# Altium schematic sheet GateDriverandMosfets.SchDoc: Gate Driver and MOSFETs
size A4; ApprovedBy: Ekrem Turan Fırat; CheckedBy: Ekrem Turan Fırat; Author: Ekrem Turan Fırat; CompanyName: Mergen Elektronik; DrawnBy: Ekrem T. Fırat; Engineer: Ekrem Turan Fırat; Organization: Mergen Elektronik; Address1: Türkiye; DocumentNumber: 20240101; Revision: v0.0.1; SheetNumber: 5; SheetTotal: 7
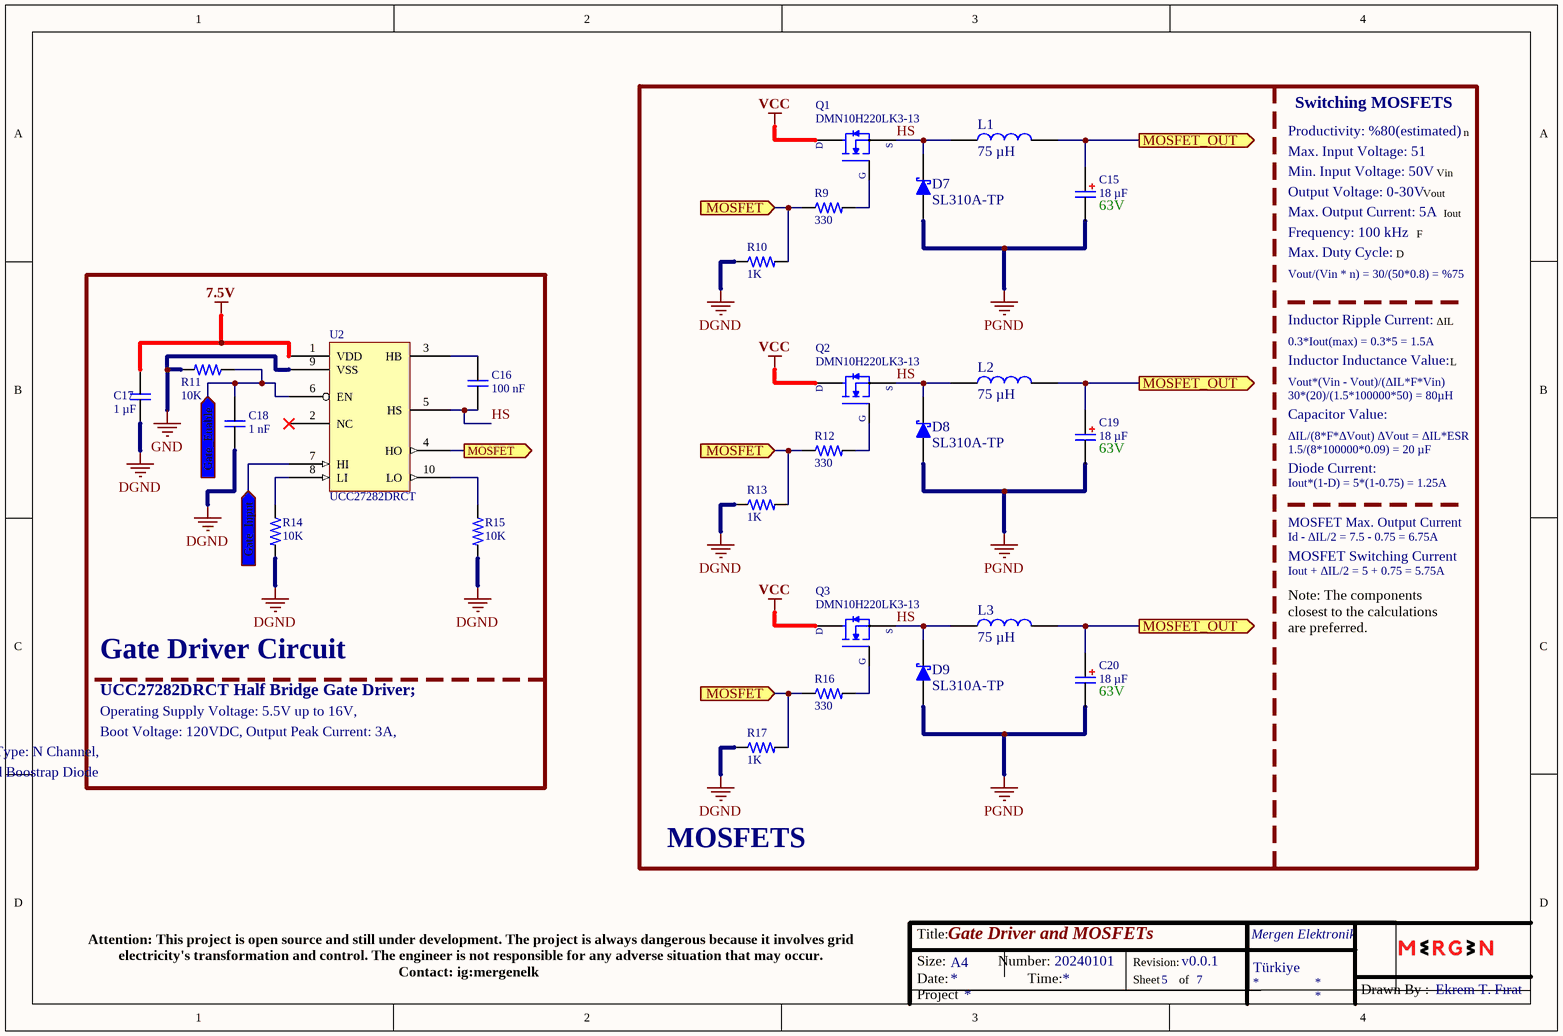
[diagram p0: GateDriverandMosfets.SchDoc]

## Parts
C15  18 µF  Voltage Rated: 63V  [MergenElektronik_Capacitors_AluminumElectrolytics_THTs_8x7MM]
C16  100 nF  [MergenElektronik_Capacitors_Ceramics_SMDs_0603_S_NS]
C17  1 µF  [MergenElektronik_Capacitors_Ceramics_SMDs_1206_S_NS]
C18  1 nF  [MergenElektronik_Capacitors_Ceramics_SMDs_0402_S_NS]
C19  18 µF  Voltage Rated: 63V  [MergenElektronik_Capacitors_AluminumElectrolytics_THTs_8x7MM]
C20  18 µF  Voltage Rated: 63V  [MergenElektronik_Capacitors_AluminumElectrolytics_THTs_8x7MM]
D7  SL310A-TP  [MergenElektronik_Diodes_SchottkyDiodes_DO-214AC (SMA)]
D8  SL310A-TP  [MergenElektronik_Diodes_SchottkyDiodes_DO-214AC (SMA)]
D9  SL310A-TP  [MergenElektronik_Diodes_SchottkyDiodes_DO-214AC (SMA)]
L1  75 µH  [MergenElektronik_Inductors_PowerInductors_SMDs_8x8x4mm_Shielded]
L2  75 µH  [MergenElektronik_Inductors_PowerInductors_SMDs_8x8x4mm_Shielded]
L3  75 µH  [MergenElektronik_Inductors_PowerInductors_SMDs_8x8x4mm_Shielded]
Q1  DMN10H220LK3-13  [MergenElektronik_Transistors_Mosfets_TO-252-3(DPAK)]
Q2  DMN10H220LK3-13  [MergenElektronik_Transistors_Mosfets_TO-252-3(DPAK)]
Q3  DMN10H220LK3-13  [MergenElektronik_Transistors_Mosfets_TO-252-3(DPAK)]
R9  330  [MergenElektronik_Resistors_ChipResistors_0603_S_NS]
R10  1K  [MergenElektronik_Resistors_ChipResistors_0603_S_NS]
R11  10K  [MergenElektronik_Resistors_ChipResistors_0603_S_NS]
R12  330  [MergenElektronik_Resistors_ChipResistors_0603_S_NS]
R13  1K  [MergenElektronik_Resistors_ChipResistors_0603_S_NS]
R14  10K  [MergenElektronik_Resistors_ChipResistors_0603_S_NS]
R15  10K  [MergenElektronik_Resistors_ChipResistors_0603_S_NS]
R16  330  [MergenElektronik_Resistors_ChipResistors_0603_S_NS]
R17  1K  [MergenElektronik_Resistors_ChipResistors_0603_S_NS]
U2  UCC27282DRCT  [MergenElektronik_Logics_GateDrivers_10VSON]

## Blocks framed on the sheet
MOSFETS: C15 C19 C20 D7-D9 L1-L3 Q1-Q3 R9 R10 R12 R13 R16 R17
Gate Driver Circuit: C16-C18 R11 R14 R15 U2

## Ports
Gate_Enable (in, see MicroController[3B]), Gate_Input (in, see MicroController[3B]), MOSFET (in, see GateDriverandMosfets[2A], GateDriverandMosfets[2B]), MOSFET (in, see GateDriverandMosfets[2A], GateDriverandMosfets[2B], GateDriverandMosfets[2C]), MOSFET (in, see GateDriverandMosfets[2B], GateDriverandMosfets[2C]), MOSFET (out, see GateDriverandMosfets[2A], GateDriverandMosfets[2B], GateDriverandMosfets[2C]), MOSFET_OUT (out, see GateDriverandMosfets[3A], GateDriverandMosfets[3B], Measuring[2C]), MOSFET_OUT (out, see GateDriverandMosfets[3A], GateDriverandMosfets[3C], Measuring[2C]), MOSFET_OUT (out, see GateDriverandMosfets[3B], GateDriverandMosfets[3C], Measuring[2C])

## Nets
7.5V: C17.1 U2.1(VDD)
DGND: C17.2 C18.2 R10.1 R13.1 R14.2 R15.2 R17.1
GND: R11.2 U2.9(VSS)
PGND: C15.KATOT C19.KATOT C20.KATOT D7.1(ANOT) D8.1(ANOT) D9.1(ANOT)
VCC: Q1.3(Drain) Q2.3(Drain) Q3.3(Drain)
Gate_Enable: C18.1 R11.1 U2.6(EN) ; port Gate_Enable
Gate_Input: U2.7(HI) ; port Gate_Input
HS: C16.2 D7.2(KATOT) D8.2(KATOT) D9.2(KATOT) L1.1 L2.1 L3.1 Q1.2(Source) Q2.2(Source) Q3.2(Source) U2.5(HS)
MOSFET: R9.1 R10.2 R12.1 R13.2 R16.1 R17.2 U2.4(HO) ; port MOSFET
MOSFET_OUT: C15.ANOT C19.ANOT C20.ANOT L1.2 L2.2 L3.2 ; port MOSFET_OUT
NetC16_1: C16.1 U2.3(HB)
NetQ1_1: Q1.1(Gate) R9.2
NetQ2_1: Q2.1(Gate) R12.2
NetQ3_1: Q3.1(Gate) R16.2
NetR14_1: R14.1 U2.8(LI)
NetR15_1: R15.1 U2.10(LO)

Not connected (* = marked no-connect by the designer): U2 2(NC)*

## Notes on the sheet
- Switching MOSFETS
- Productivity: %80(estimated)
- Max. Input Voltage: 51
- Min. Input Voltage: 50V
- Vin
- n
- Output Voltage: 0-30V
- Max. Output Current: 5A
- Frequency: 100 kHz
- F
- Vout
- Iout
- Max. Duty Cycle:
- Vout/(Vin * n) = 30/(50*0.8) = %75
- D
- Inductor Ripple Current:
- 0.3*Iout(max) = 0.3*5 = 1.5A
- Inductor Inductance Value:
- Vout*(Vin - Vout)/(ΔIL*F*Vin)
- ΔIL
- L
- 30*(20)/(1.5*100000*50) = 80µH
- Capacitor Value:
- ΔIL/(8*F*ΔVout) ΔVout = ΔIL*ESR
- 1.5/(8*100000*0.09) = 20 µF
- Diode Current:
- Iout*(1-D) = 5*(1-0.75) = 1.25A
- MOSFET Max. Output Current
- Id - ΔIL/2 = 7.5 - 0.75 = 6.75A
- MOSFET Switching Current
- Iout + ΔIL/2 = 5 + 0.75 = 5.75A
- Note: The components closest to the calculations are preferred.
- UCC27282DRCT Half Bridge Gate Driver;
- Operating Supply Voltage: 5.5V up to 16V,
- Boot Voltage: 120VDC, Output Peak Current: 3A,
- Integreted Boostrap Diode
- Gate Type: N Channel,
- Attention: This project is open source and still under development. The project is always dangerous because it involves grid electricity's transformation and control. The engineer is not responsible for any adverse situation that may occur.
  Contact: ig:mergenelk
- Title:
- Size:
- Date:
- A4
- Number:
- Time:
- Revision:
- Sheet
- of
- Project
- Drawn By :
- (in symbol MergenElektronik_Transistors_Mosfets_DMN10H220LK3-13) D; S; G

## Library data of the parts
C15 C19 C20 = MergenElektronik_Capacitors_AluminumElectrolytics_SMDs_63SXE18M: Mergen Elektronik- Capacitors - Aluminum Electrolytics - THTs - 63SXE18M; Manufacturer: Panasonic; Manufacturer Number: 100SXE6R8M; Model: Aluminum Electrolytic Capacitors; Tolerance: ±20%; Value: 18 µF; Temperature: -55°C up to +125°C; Digi-Key Number: P122614-ND; Package: 8x7mm; Farnell Number: 2920530; Mouser Number: 667-63SXE18M; Mounting Type: Through Hole; Supplier 1: Digikey; Supplier 2: Mouser; Supplier Part Number 1: P122614-ND; Supplier Part Number 2: 667-63SXE18M; Özdisan Number: 63SXE18M
C16 = MergenElektronik_Capacitors_Ceramic_SMDs_100nF_100V: Mergen Elektronik - Capacitors - Ceramics - SMDs - 0603 - 100 nF - 100V; Manufacturer: Samsung; Manufacturer Number: CL10B104KC8NNNC; Model: Ceramic Capacitors; Tolerance: ±10%; Value: 100 nF; Temperature: -55°C up to +125°C; Digi-Key Number: 1276-6807-1-ND; Package: 0603(1608 Metric); Mouser Number: 187-CL10B104KC8NNNC; Mounting Type: Surface Mount; Farnell Number: 3013412; Özdisan Number: CL10B104KC8NNNC; Supplier 1: Digikey; Supplier 2: Mouser; Supplier Part Number 1: 1276-6807-1-ND; Supplier Part Number 2: 187-CL10B104KC8NNNC; Voltage Rated: 100V
C17 = MergenElektronik_Capacitors_Ceramic_SMDs_1µF_100V: Mergen Elektronik - Capacitors - Ceramics - SMDs - 1206 - 1 µF - 100V; Manufacturer: Samsung; Manufacturer Number: CL31B105KCHNNNE; Model: Ceramic Capacitors; Tolerance: ±10%; Value: 1 µF; Temperature: -55°C up to +125°C; Digi-Key Number: 1276-1838-1-ND; Package: 1206(3216 Metric); Mouser Number: 187-CL31B105KCHNNNE; Mounting Type: Surface Mount; Özdisan Number: CL31B105KCHNNNE; Supplier 1: Digikey; Supplier 2: Mouser; Supplier Part Number 1: 1276-1838-1-ND; Supplier Part Number 2: 187-CL31B105KCHNNNE; Voltage Rated: 100V
C18 = MergenElektronik_Capacitors_Ceramic_SMDs_1nF_50V: Mergen Elektronik - Capacitors - Ceramics - SMDs - 0402 - 1 nF - 50V; Manufacturer: Murata Electronics; Manufacturer Number: GRM1555C1H102JA01D; Model: Ceramic Capacitors; Tolerance: ±5%; Value: 1 nF; Temperature: -55°C up to +125°C; Digi-Key Number: 490-3244-1-ND; Package: 0402(1005 Metric); Mouser Number: 81-GRM1555C1H102JA1D; Mounting Type: Surface Mount; Farnell Number: 8819556; Özdisan Number: GRM1555C1H102JA01D; Supplier 1: Digikey; Supplier 2: Mouser; Voltage Rated: 50V; Supplier Part Number 1: 490-3244-1-ND; Supplier Part Number 2: 81-GRM1555C1H102JA1D
D7-D9 = MergenElektronik_Diodes_SchottkyDiodes_SL310A-TP: Mergen Elektronik - Diodes - Schottky Diodes - SL310A-TP; Manufacturer: Micro Commercial Co; Voltage Rated: 100V; Current Rating: 3A; Value: VSSB7L45-M3/52T; Digi-Key Number: SL310A-TPMSTR-ND; Manufacturer Number: SL310A-TP; Model: Schottky Diodes; Mounting Type: Surface Mount; Package: DO-214AC(SMA); Temperature: -55°C up to +150°C; Supplier 1: Digikey; Supplier 2: Mouser; Supplier Part Number 1: SL310A-TPMSDKR-ND; Supplier Part Number 2: 833-SL310A-TP; Mouser Number: 833-SL310A-TP
L1-L3 = MergenElektronik_Inductors_PowerInductors_SMDs_ASPI-8040S-750M-T: Mergen Elektronik - Inductors - Power Inductors - SMDs - 8x8mm  75-µh - 1.2A; Manufacturer: Abracon LLC; Digi-Key Number: 535-13053-1-ND; Manufacturer Number: ASPI-8040S-750M-T; Model: Power Inductor; Mounting Type: Surface Mount; Package: 8x8x4mm Shielded; Temperature: -40°C up to  125°C; Value: 75 µH; Current Rating: 1.2A; Mouser Number: 815-ASPI-8040S-750MT; Supplier 1: Digikey; Supplier 2: Mouser; Supplier Part Number 1: 535-13053-1-ND; Supplier Part Number 2: 815-ASPI-8040S-750MT
Q1-Q3 = MergenElektronik_Transistors_Mosfets_DMN10H220LK3-13: Mergen Elektronik - Transistors - Mosfets - DMN10H220LK3-13; Manufacturer: Diodes Incorporated; Voltage Rated: 100V; Model: Mosfet; Id: 7.5A; Value: DMN10H220LK3-13; Temperature: -55°C up to +175°C (TJ); Digi-Key Number: 31-DMN10H220LK3-13CT-ND; Manufacturer Number: DMN10H220LK3-13; Package: TO-252-3 DPAK; Mounting Type: Surface Mount; Vdss: 100V; Rating Current: 7.5A; Mouser Number: 621-DMN10H220LK3-13; Farnell Number: 3943521RL; Current Rating: 7.5A; Supplier 1: Digikey; Supplier 2: Mouser; Supplier Part Number 1: 31-DMN10H220LK3-13CT-ND; Supplier Part Number 2: 621-DMN10H220LK3-13
R9 R12 R16 = MergenElektronik_Resistors_ChipResistors_0603_330R: Mergen Elektronik - Resistors - Chip Resistors - 0603 - 330R; Manufacturer: Stackpole; Manufacturer Number: RMCF0603JT330R; Value: Chip Resistor - 0603 - 330R; Power: 1/10W; Tolerance: ±5%; Package: 0603(1608); Temperature: -55°C up to +155°C - X8R; Model: Chip Resistor; Digi-Key Number: RMCF0603JT330RCT-ND; Mounting Type: Surface Mount; Supplier 1: Digi-Key; Supplier Part Number 1: RMCF0603JT330RCT-ND
R10 R13 R17 = MergenElektronik_Resistors_ChipResistors_0603_1K: Mergen Elektronik - Resistors - Chip Resistors - 0603 - 1K; Manufacturer: Stackpole; Manufacturer Number: RMCF0603JT1K00; Value: Chip Resistor - 0603 - 1K; Power: 1/10W; Tolerance: ±5%; Package: 0603(1608); Temperature: -55°C up to +155°C - X8R; Model: Chip Resistor; Digi-Key Number: RMCF0603JT1K00CT-ND; Mounting Type: Surface Mount; Mouser Number: 708-RMCF0603JT1K00; Supplier 1: Digikey; Supplier 2: Mouser; Supplier Part Number 1: RMCF0603JT1K00DKR-ND; Supplier Part Number 2: 708-RMCF0603JT1K00
R11 R14 R15 = MergenElektronik_Resistors_ChipResistors_0603_10K: Mergen Elektronik - Resistors - Chip Resistors - 0603 - 10K; Manufacturer: Stackpole; Manufacturer Number: RMCF0603JT10K0; Value: Chip Resistor - 0603 - 10K; Power: 1/10W; Tolerance: ±5%; Package: 0603(1608); Temperature: -55°C up to +155°C - X8R; Model: Chip Resistor; Digi-Key Number: RMCF0603JT10K0CT-ND; Mounting Type: Surface Mount; Supplier 1: Digi-Key; Supplier Part Number 1: RMCF0603JT10K0-ND
U2 = MergenElektronik_Logics_GateDrivers_UCC27282DRCT: Mergen Elektronik - Logics - Gate Drivers - UCC27282DRCT; Manufacturer: Texas Instruments; Operating Supply Voltage: 5.5V up to 16VDC; Voltage Rated: 120VDC; Current Rating: 3A; Gate Driver Type: Half Bridge; Channel Type: İndependent; Gaye Type: N-Channel MOSFET; Digi-Key Number: 296-53422-1-ND; Manufacturer Number: UCC27282DRCT; Model: Gate Driver; Mounting Type: Surface Mount; Mouser Number: 595-UCC27282DRCT; Package: 10-VSON 3x3; Temperature: -40°C up to 125°C; Value: UCC27282DRCT; Supplier 1: Digikey; Supplier 2: Mouser; Supplier Part Number 1: 296-53422-1-ND; Supplier Part Number 2: 595-UCC27282DRCT